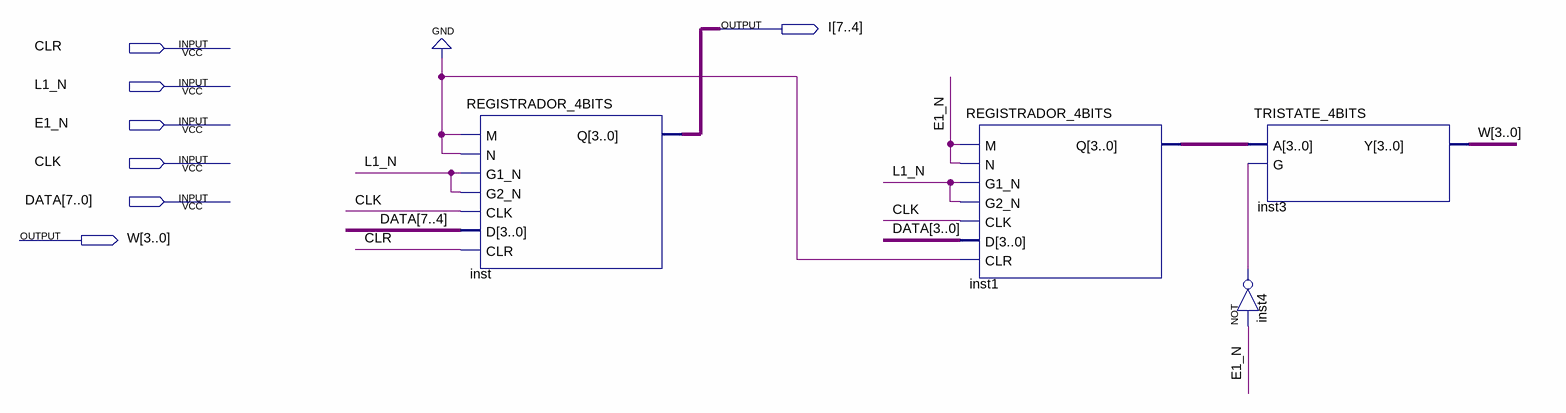
[diagram p0: schematic sheet]
// Quartus schematic IR.bdf as structural Verilog: 4 symbols, 7 pins
module IR (
  input  CLR,
  input  L1_N,
  input  E1_N,
  input  CLK,
  input  [7:0] DATA,
  output [7:4] I,
  output [3:0] W
);

  wire inst4_out;
  wire [3:0] inst1_q;

  REGISTRADOR_4BITS inst (.M(1'b0), .N(1'b0), .G1_N(L1_N), .G2_N(L1_N), .CLK(CLK), .D(DATA[7:4]), .CLR(CLR), .Q(I));
  REGISTRADOR_4BITS inst1 (
    .M(E1_N), .N(E1_N), .G1_N(L1_N), .G2_N(L1_N), .CLK(CLK), .D(DATA[3:0]), .CLR(1'b0), .Q(inst1_q));
  TRISTATE_4BITS inst3 (.A(inst1_q), .G(inst4_out), .Y(W));
  not inst4 (inst4_out, E1_N);
endmodule
